# Altium schematic sheet 01_MAIN.SchDoc: =GlobalProjectName
size 594 x 420 mm; CheckedBy: A_D; Author: A_D; SheetTotal: 1; PageSetup: Record=PageOptions|CenterHorizontal=True|CenterVertical=True|PrintScale=0.70|XCorrection=1.00|YCorrection=1.00|PrintKind=2|BorderSize=5000000|LeftOffset=9000|BottomOffset=10100|Orientation=2|PaperLength=11176|PaperWidth=8636|Scale=100|PaperSource=259|PrintQuality=-3|MediaType=1|DitherType=10|PrintScaleMode=1|PaperKind=A3|PaperIndex=8
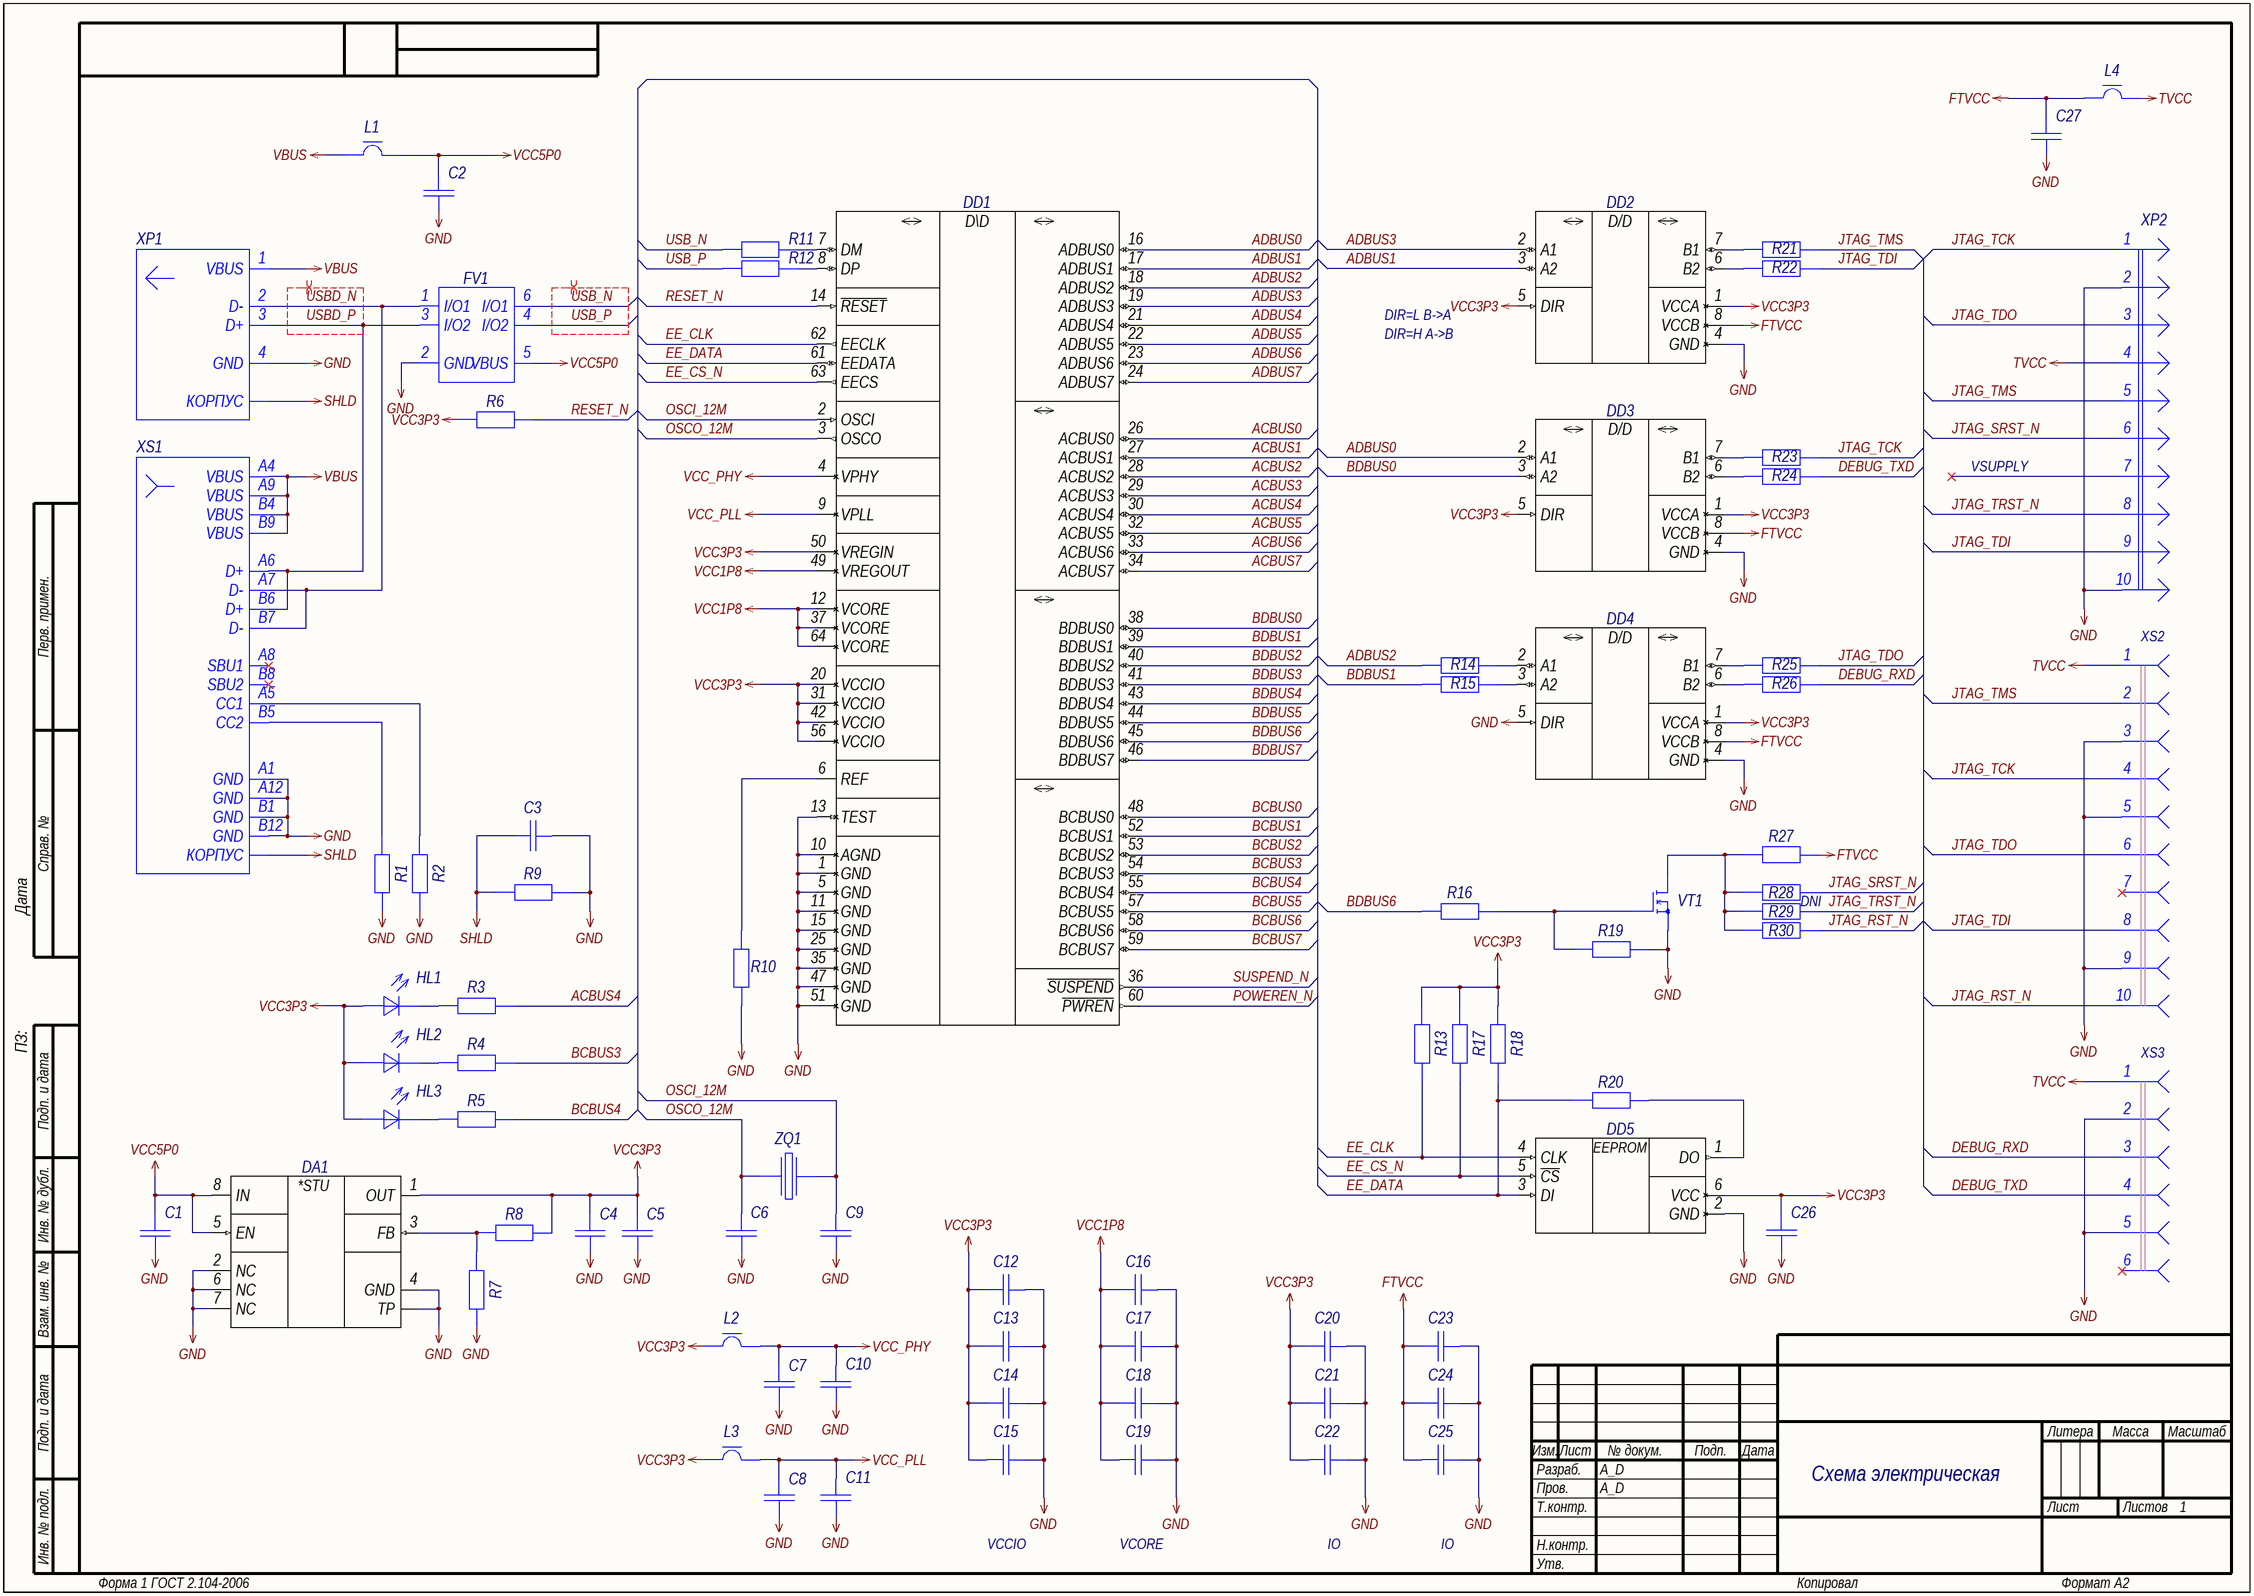
[diagram p0: 01_MAIN.SchDoc]

## Parts
C1  Capacitor  [C0402_L]  (value not drawn)
C2  Capacitor  [C0603_L]  (value not drawn)
C3  (no value)  [C0402_L]
C4  Capacitor  [C0402_L]  (value not drawn)
C5  Capacitor  [C0402_L]  (value not drawn)
C6  Capacitor  [C0402_L]  (value not drawn)
C7  Capacitor  [C0402_L]  (value not drawn)
C8  Capacitor  [C0402_L]  (value not drawn)
C9  Capacitor  [C0402_L]  (value not drawn)
C10  Capacitor  [C0402_L]  (value not drawn)
C11  Capacitor  [C0402_L]  (value not drawn)
C12  Capacitor  [C0402_L]  (value not drawn)
C13  Capacitor  [C0402_L]  (value not drawn)
C14  Capacitor  [C0402_L]  (value not drawn)
C15  Capacitor  [C0402_L]  (value not drawn)
C16  Capacitor  [C0402_L]  (value not drawn)
C17  Capacitor  [C0402_L]  (value not drawn)
C18  Capacitor  [C0402_L]  (value not drawn)
C19  Capacitor  [C0402_L]  (value not drawn)
C20  Capacitor  [C0402_L]  (value not drawn)
C21  Capacitor  [C0402_L]  (value not drawn)
C22  Capacitor  [C0402_L]  (value not drawn)
C23  Capacitor  [C0402_L]  (value not drawn)
C24  Capacitor  [C0402_L]  (value not drawn)
C25  Capacitor  [C0402_L]  (value not drawn)
C26  Capacitor  [C0402_L]  (value not drawn)
C27  Capacitor  [C0402_L]  (value not drawn)
DA1  TPS73701DRB  [VSON-8_065P300X300X100_N]  (value not drawn)
DD1  FT2232Hx-Series  [LQFP-64_050P1000X1000X160_N]  (value not drawn)
DD2  SN74LVC2T45DCx-Series  [VSSOP-8_050P200X230X090_N]  (value not drawn)
DD3  SN74LVC2T45DCx-Series  [VSSOP-8_050P200X230X090_N]  (value not drawn)
DD4  SN74LVC2T45DCx-Series  [VSSOP-8_050P200X230X090_N]  (value not drawn)
DD5  93xx56xx-OT-Series  [SOT-23-6_095P290X160X145_N]  (value not drawn)
FV1  USBLC6-2x6  [SOT-666_050P160X120X060_N]  (value not drawn)
HL1  Text  [LD0402]  (value not drawn)
HL2  Text  [LD0402]  (value not drawn)
HL3  Text  [LD0402]  (value not drawn)
L1  FerriteBead  [L0402_L]  (value not drawn)
L2  FerriteBead  [L0402_L]  (value not drawn)
L3  FerriteBead  [L0402_L]  (value not drawn)
L4  FerriteBead  [L0402_L]  (value not drawn)
R1  Resistor  [R0402_L]  (value not drawn)
R2  Resistor  [R0402_L]  (value not drawn)
R3  Resistor  [R0402_L]  (value not drawn)
R4  Resistor  [R0402_L]  (value not drawn)
R5  Resistor  [R0402_L]  (value not drawn)
R6  Resistor  [R0402_L]  (value not drawn)
R7  Resistor  [R0402_L]  (value not drawn)
R8  Resistor  [R0402_L]  (value not drawn)
R9  (no value)  [R0402_L]
R10  Resistor  [R0402_L]  (value not drawn)
R11  Resistor  [R0402_L]  (value not drawn)
R12  Resistor  [R0402_L]  (value not drawn)
R13  Resistor  [R0402_L]  (value not drawn)
R14  Resistor  [R0402_L]  (value not drawn)
R15  Resistor  [R0402_L]  (value not drawn)
R16  Resistor  [R0402_L]  (value not drawn)
R17  Resistor  [R0402_L]  (value not drawn)
R18  Resistor  [R0402_L]  (value not drawn)
R19  Resistor  [R0402_L]  (value not drawn)
R20  Resistor  [R0402_L]  (value not drawn)
R21  Resistor  [R0402_L]  (value not drawn)
R22  Resistor  [R0402_L]  (value not drawn)
R23  Resistor  [R0402_L]  (value not drawn)
R24  Resistor  [R0402_L]  (value not drawn)
R25  Resistor  [R0402_L]  (value not drawn)
R26  Resistor  [R0402_L]  (value not drawn)
R27  Resistor  [R0402_L]  (value not drawn)
R28  Resistor  [R0402_L]  (value not drawn)
R29  Resistor  [R0402_L]  (value not drawn)  (no BOM)
R30  Resistor  [R0402_L]  (value not drawn)
VT1  MOSFET-N_32  [SOT-883B_035P060X100X040_N]  (value not drawn)
XP1  Text  [DS1097]  (value not drawn)
XP2  JTAG  [IDC-10MR]  (value not drawn)
XS1  Text  [U262-161N-4BVC11]  (value not drawn)
XS2  JTAG-FFC  [XF2M-1015-1A]  (value not drawn)  (parts A,B,C,D,E,F,G,H,I,J of 10)
XS3  SWO  [XF2M-0615-1A]  (value not drawn)  (parts A,B,C,D,E,F of 6)
ZQ1  Crystal-1_3p  [SMD 3.2x2.5mm]  (value not drawn)

## Nets
FTVCC: C23.2 C24.2 C25.2 C27.2 DD2.8(VCCB) DD3.8(VCCB) DD4.8(VCCB) L4.1 R27.2
GND: C1.1 C2.1 C3.1 C4.1 C5.1 C6.1 C7.1 C8.1 C9.1 C10.1 C11.1 C12.1 C13.1 C14.1 C15.1 C16.1 C17.1 C18.1 C19.1 C20.1 C21.1 C22.1 C23.1 C24.1 C25.1 C26.2 C27.1 DA1.2(NC) DA1.4(GND) DA1.6(NC) DA1.7(NC) DA1.TP DD1.1(GND) DD1.5(GND) DD1.10(AGND) DD1.11(GND) DD1.13(TEST) DD1.15(GND) DD1.25(GND) DD1.35(GND) DD1.47(GND) DD1.51(GND) DD2.4(GND) DD3.4(GND) DD4.4(GND) DD4.5(DIR) DD5.2(GND) FV1.2(GND) R1.1 R2.1 R7.1 R9.2 R10.1 R19.2 VT1.2(S) XP1.4(GND) XP2.2 XP2.10 XS1.A1(GND) XS1.A12(GND) XS1.B1(GND) XS1.B12(GND) XS2.3 XS2.5 XS2.9 XS3.2 XS3.5
SHLD: C3.2 R9.1 XP1.SH(КОРПУС) XS1.SH(КОРПУС)
TVCC: L4.2 XP2.4 XS2.1 XS3.1
VBUS: L1.1 XP1.1(VBUS) XS1.A4(VBUS) XS1.A9(VBUS) XS1.B4(VBUS) XS1.B9(VBUS)
VCC1P8: C16.2 C17.2 C18.2 C19.2 DD1.12(VCORE) DD1.37(VCORE) DD1.49(VREGOUT) DD1.64(VCORE)
VCC3P3: C4.2 C5.2 C12.2 C13.2 C14.2 C15.2 C20.2 C21.2 C22.2 C26.1 DA1.1(OUT) DD1.20(VCCIO) DD1.31(VCCIO) DD1.42(VCCIO) DD1.50(VREGIN) DD1.56(VCCIO) DD2.1(VCCA) DD2.5(DIR) DD3.1(VCCA) DD3.5(DIR) DD4.1(VCCA) DD5.6(VCC) HL1.1(А) HL2.1(А) HL3.1(А) L2.1 L3.1 R6.1 R8.2 R13.2 R17.2 R18.2
VCC5P0: C1.2 C2.2 DA1.5(EN) DA1.8(IN) FV1.5(VBUS) L1.2
VCC_PHY: C7.2 C10.2 DD1.4(VPHY) L2.2
VCC_PLL: C8.2 C11.2 DD1.9(VPLL) L3.2
ACBUS0: DD1.26(ACBUS0)
ACBUS1: DD1.27(ACBUS1)
ACBUS2: DD1.28(ACBUS2)
ACBUS3: DD1.29(ACBUS3)
ACBUS4: DD1.30(ACBUS4) R3.2
ACBUS5: DD1.32(ACBUS5)
ACBUS6: DD1.33(ACBUS6)
ACBUS7: DD1.34(ACBUS7)
ADBUS0: DD1.16(ADBUS0) DD3.2(A1)
ADBUS1: DD1.17(ADBUS1) DD2.3(A2)
ADBUS2: DD1.18(ADBUS2) R14.1
ADBUS3: DD1.19(ADBUS3) DD2.2(A1)
ADBUS4: DD1.21(ADBUS4)
ADBUS5: DD1.22(ADBUS5)
ADBUS6: DD1.23(ADBUS6)
ADBUS7: DD1.24(ADBUS7)
BCBUS0: DD1.48(BCBUS0)
BCBUS1: DD1.52(BCBUS1)
BCBUS2: DD1.53(BCBUS2)
BCBUS3: DD1.54(BCBUS3) R4.2
BCBUS4: DD1.55(BCBUS4) R5.2
BCBUS5: DD1.57(BCBUS5)
BCBUS6: DD1.58(BCBUS6)
BCBUS7: DD1.59(BCBUS7)
BDBUS0: DD1.38(BDBUS0) DD3.3(A2)
BDBUS1: DD1.39(BDBUS1) R15.1
BDBUS2: DD1.40(BDBUS2)
BDBUS3: DD1.41(BDBUS3)
BDBUS4: DD1.43(BDBUS4)
BDBUS5: DD1.44(BDBUS5)
BDBUS6: DD1.45(BDBUS6) R16.1
BDBUS7: DD1.46(BDBUS7)
DEBUG_RXD: R26.2 XS3.3
DEBUG_TXD: R24.2 XS3.4
EE_CLK: DD1.62(EECLK) DD5.4(CLK) R13.1
EE_CS_N: DD1.63(EECS) DD5.5(~{CS}) R17.1
EE_DATA: DD1.61(EEDATA) DD5.3(DI) R18.1 R20.1
JTAG_RST_N: R30.2 XS2.10
JTAG_SRST_N: R28.2 XP2.6
JTAG_TCK: R23.2 XP2.1 XS2.4
JTAG_TDI: R22.2 XP2.9 XS2.8
JTAG_TDO: R25.2 XP2.3 XS2.6
JTAG_TMS: R21.2 XP2.5 XS2.2
JTAG_TRST_N: R29.2 XP2.8
OSCI_12M: C9.2 DD1.2(OSCI) ZQ1.3
OSCO_12M: C6.2 DD1.3(OSCO) ZQ1.1
POWEREN_N: DD1.60(~{PWREN})
RESET_N: DD1.14(~{RESET}) R6.2
SUSPEND_N: DD1.36(~{SUSPEND})
USB_N: FV1.6(I/O1) R11.1
USB_P: FV1.4(I/O2) R12.1
USBD_N: FV1.1(I/O1) XP1.2(D-) XS1.A7(D-) XS1.B7(D-)
USBD_P: FV1.3(I/O2) XP1.3(D+) XS1.A6(D+) XS1.B6(D+)
NetDA1_3: DA1.3(FB) R7.2 R8.1
NetDD1_6: DD1.6(REF) R10.2
NetDD1_7: DD1.7(DM) R11.2
NetDD1_8: DD1.8(DP) R12.2
NetDD2_6: DD2.6(B2) R22.1
NetDD2_7: DD2.7(B1) R21.1
NetDD3_6: DD3.6(B2) R24.1
NetDD3_7: DD3.7(B1) R23.1
NetDD4_2: DD4.2(A1) R14.2
NetDD4_3: DD4.3(A2) R15.2
NetDD4_6: DD4.6(B2) R26.1
NetDD4_7: DD4.7(B1) R25.1
NetDD5_1: DD5.1(DO) R20.2
NetHL1_2: HL1.2(К) R3.1
NetHL2_2: HL2.2(К) R4.1
NetHL3_2: HL3.2(К) R5.1
NetR1_2: R1.2 XS1.B5(CC2)
NetR2_2: R2.2 XS1.A5(CC1)
NetR16_2: R16.2 R19.1 VT1.1(G)
NetR27_1: R27.1 R28.1 R29.1 R30.1 VT1.3(D)

Not connected (* = marked no-connect by the designer): XP2 7*; XS1 A8(SBU1)* B8(SBU2)*; XS2 7*; XS3 6*

## Layout directives
differential pair; differential pair class USBD: USBD_N, USBD_P
differential pair; differential pair class USB: USB_N, USB_P

## Notes on the sheet
- DIR=L B->A
- DIR=H A->B
- VSUPPLY
- (near XS2) XS2
- DNI
- (near XS3) XS3
- Схема электрическая
  принципиальная
- VCCIO
- VCORE
- IO
- Перв. примен.
- Справ. №
- ПЗ:                             Дата
- Подп. и дата
- Инв. № дубл.
- Взам. инв. №
- Разраб.
- Изм.
- Лист
- № докум.
- Подп.
- Дата
- Литера
- Масса
- Масштаб
- Пров.
- Т.контр.
- Листов
- Инв. № подл.
- Н.контр.
- Утв.
- Форма 1 ГОСТ 2.104-2006
- Копировал
- Формат А2
- (in symbol 93LC56BT-I/OT) EEPROM
- (in symbol FT2232HL) D\D
- (in symbol SN74LVC2T45DCUR) D/D
- (in symbol TPS73701DRBR) *STU

## Library data of the parts
C1 = GRM155R61C105KA12D: Manufacturer: Murata; Type: Конденсатор; ID: 272; Value: 1uF; Voltage: 16V; Tolerance: ±10%; Dielectric Type: X5R; Application Category: 1; Working Temperature Min: -55°С; Working Temperature Max: +85°С; Published: 18.05.2010; Publisher: Andrew Danich; Part Number: GRM155R61C105KA12D; Footprint: 0402; ClassName: DirectConnect
C2 = GRM188R61A106KE69D: Manufacturer: Murata; Type: Конденсатор; ID: 173; Value: 10uF; Voltage: 10V; Tolerance: ±10%; Dielectric Type: X5R; Application Category: 1; Working Temperature Min: -55°С; Working Temperature Max: +85°С; Published: 18.05.2010; Publisher: Andrew Danich; Part Number: GRM188R61A106KE69D; Footprint: 0603; ClassName: DirectConnect
C3 = GCM155R71C104KA55D: Manufacturer: Murata; Type: Конденсатор; ID: 163; Value: 0.1uF; Voltage: 16V; Tolerance: ±10%; Dielectric Type: X7R; Application Category: 1; Working Temperature Min: -55°С; Working Temperature Max: +125°С; Functional Analog: GRM155R71C104KA88D; Published: 18.05.2010; Publisher: Andrew Danich; Part Number: GCM155R71C104KA55D; Footprint: 0402; ClassName: DirectConnect
C4 C5 C7 C8 C16 = GRM155R60J475ME87D: Manufacturer: Murata; Type: Конденсатор; ID: 223; Value: 4.7uF; Voltage: 6.3V; Tolerance: ±20%; Dielectric Type: X5R; Application Category: 1; Working Temperature Min: -55°С; Working Temperature Max: +85°С; Published: 18.05.2010; Publisher: Andrew Danich; Part Number: GRM155R60J475ME87D; Footprint: 0402; ClassName: DirectConnect
C6 C9 = GJM1555C1H120GB01D: Manufacturer: Murata; Type: Конденсатор; Schematic Value: 12pF, 50V, NP0; ID: 257; Value: 12pF; Voltage: 50V; Tolerance: ±2%; Dielectric Type: NP0; Application Category: 1; Working Temperature Min: -55°С; Working Temperature Max: +125°С; Published: 18.05.2010; Publisher: Andrew Danich; Part Number: GJM1555C1H120GB01D; Footprint: 0402
C10-C15 C17-C26 = GCM155R71C104KA55D: Manufacturer: Murata; Type: Конденсатор; Schematic Value: 0.1uF, 16V, X7R; ID: 163; Value: 0.1uF; Voltage: 16V; Tolerance: ±10%; Dielectric Type: X7R; Application Category: 1; Working Temperature Min: -55°С; Working Temperature Max: +125°С; Functional Analog: GRM155R71C104KA88D; Published: 18.05.2010; Publisher: Andrew Danich; Part Number: GCM155R71C104KA55D; Footprint: 0402
C27 = GRM155D71C225ME11D: Manufacturer: Murata; Type: Конденсатор; ID: 180; Value: 2.2uF; Voltage: 16V; Tolerance: ±20%; Dielectric Type: X7T; Application Category: 1; Working Temperature Min: -55°С; Working Temperature Max: +125°С; Functional Analog: GRM155R60J225ME15D; Published: 18.05.2010; Publisher: Andrew Danich; Part Number: GRM155D71C225ME11D; Footprint: 0402; ClassName: DirectConnect
DA1 = TPS73701DRBR: Manufacturer: Texas Instruments; ID: 26; Input Voltage: +2.2…5.5V; Output Current: 1A; Output Voltage: +1.2…5.5V; Application Category: 1; Working Temperature Min: -40°С; Working Temperature Max: +125°С; Functional Analog: TPS73701DRBT; Published: 25.03.2019; Publisher: Andrew Danich; Type: Микросхема; Part Number: TPS73701DRBR; Value: TPS73701DRBR; ClassName: DirectConnect
DD1 = FT2232HL: Manufacturer: FTDI; ID: 3; Supply Operation: +3.3V; Supply Current: 70mA; USB Type Support: USB 2.0; USB Speed Support: 12 Mb/s; OTG Support: No; Input Interface: UART, FIFO, SPI, JTAG, I2C; Channels: 2; Application Category: 1; Working Temperature Min: -40°C; Working Temperature Max: +85°C; Published: 19.06.2020; Publisher: Andrew Danich; Type: Микросхема; Part Number: FT2232HL; Value: FT2232HL; Functional Analog: -
DD2-DD4 = SN74LVC2T45DCUR: Manufacturer: Texas Instruments; ID: 18; Supply 1 Operation: +1,65…5,5V; Supply Current: 10uA; Directional: Unidirection; Channels: 2; Max Data Rate: 420Mbps; Application Category: 1; Working Temperature Min: -40°С; Working Temperature Max: +85°С; Functional Analog: 74LVCH2T45DC,125; Published: 06.03.2020; Publisher: Andrew Danich; Type: Микросхема; Part Number: SN74LVC2T45DCUR; Value: SN74LVC2T45DCUR; Supply 2 Operation: +1,65…5,5V
DD5 = 93LC56BT-I/OT: Manufacturer: Microchip; ID: 18; Supply Operation: +2.5…5.5V; Supply Current: 2mA; Memory: 2Kbit; Addressable: NO; Interface: SPI; Clock Frequency: 2MHz; Application Category: 1; Working Temperature Min: -40°С; Working Temperature Max: +85°С; Published: 19.06.2020; Type: Микросхема; Publisher: Andrew Danich; Part Number: 93LC56BT-I/OT; Value: 93LC56BT-I/OT
FV1 = USBLC6-2P6: Manufacturer: STMicroelectronics; ID: 30; Breakdown Voltage: 6V; Reverse Stand Off Voltage: 17V; Forward Voltage: 0.95V; Peak Forward Current: 5A; Junction Capacitance: 2.5pF; Directional: Bidirectional; Application Category: 1; Working Temperature Min: -40°С; Working Temperature Max: +125°С; Published: 21.02.2017; Publisher: Andrew Danich; Type: Супрессор; Part Number: USBLC6-2P6; Value: USBLC6-2P6; Functional Analog: -; ClassName: DirectConnect
HL1-HL3 = KPHHS-1005QBC-D-V: Manufacturer: Kingbright; Type: Индикатор единичный; ID: 24; Forward Voltage: 3.3V; Forward Current: 20mA; Power Dissipation: 120mW; Luminous Flux: 60; Color: Blue; Leds: 1; Working Temperature Min: -40°С; Working Temperature Max: +85°С; Published: 03.12.2013; Publisher: Andrew Danich; Part Number: KPHHS-1005QBC-D-V; Value: KPHHS-1005QBC-D-V; Footprint: 0402; Application Category: 1
L1-L4 = BLM15PD121SN1D: Manufacturer: Murata; Type: Дроссель; ID: 11; Rated Current: 1.3A; Impedance at 100Mhz: 120ohm; Tolerance: ±25%; DC Resistance: 0.09ohm; Inductor Type: EMIFIL; Application Category: 1; Working Temperature Min: -55°С; Working Temperature Max: +125°С; Published: 14.11.2014; Publisher: Andrew Danich; Part Number: BLM15PD121SN1D; Value: BLM15PD121SN1D; Footprint: 0402
  L1 L4: ClassName: DirectConnect
R1 R2 = RC0402FR-075K1L: Manufacturer: Yageo; ID: 496; Value: 5.1k; Limit Voltage: 50V; Tolerance: ±1%; Temperature Coefficient: 100ppm; Total Power Dissipation: 0.1W; Series Type: Thick-Film; Application Category: 1; Working Temperature Min: -55°С; Working Temperature Max: +155°С; Published: 24.03.2010; Publisher: Andrew Danich; Type: Резистор; Part Number: RC0402FR-075K1L; Footprint: 0402
R3-R5 = RC0402JR-071KL: Manufacturer: Yageo; ID: 3; Value: 1k; Limit Voltage: 50V; Tolerance: ±5%; Temperature Coefficient: 100ppm; Total Power Dissipation: 0.1W; Series Type: Thick-Film; Application Category: 1; Working Temperature Min: -55°С; Working Temperature Max: +155°С; Published: 24.03.2010; Publisher: Andrew Danich; Type: Резистор; Part Number: RC0402JR-071KL; Footprint: 0402
R6 = RC0402JR-071KL: Manufacturer: Yageo; Schematic Value: 1k ±5%; ID: 3; Value: 1k; Limit Voltage: 50V; Tolerance: ±5%; Temperature Coefficient: 100ppm; Total Power Dissipation: 0.1W; Series Type: Thick-Film; Application Category: 1; Working Temperature Min: -55°С; Working Temperature Max: +155°С; Published: 24.03.2010; Publisher: Andrew Danich; Type: Резистор; Part Number: RC0402JR-071KL; Footprint: 0402
R7 = RC0402FR-0712KL: Manufacturer: Yageo; ID: 318; Value: 12k; Limit Voltage: 50V; Tolerance: ±1%; Temperature Coefficient: 100ppm; Total Power Dissipation: 0.1W; Series Type: Thick-Film; Application Category: 1; Working Temperature Min: -55°С; Working Temperature Max: +155°С; Published: 24.03.2010; Publisher: Andrew Danich; Type: Резистор; Part Number: RC0402FR-0712KL; Footprint: 0402
R8 = RC0402FR-0722K1L: Manufacturer: Yageo; ID: 447; Value: 22.1k; Limit Voltage: 50V; Tolerance: ±1%; Temperature Coefficient: 100ppm; Total Power Dissipation: 0.1W; Series Type: Thick-Film; Application Category: 1; Working Temperature Min: -55°С; Working Temperature Max: +155°С; Published: 24.03.2010; Publisher: Andrew Danich; Type: Резистор; Part Number: RC0402FR-0722K1L; Footprint: 0402
R9 = RC0402JR-07100KL: Manufacturer: Yageo; ID: 351; Value: 100k; Limit Voltage: 50V; Tolerance: ±5%; Temperature Coefficient: 100ppm; Total Power Dissipation: 0.1W; Series Type: Thick-Film; Application Category: 1; Working Temperature Min: -55°С; Working Temperature Max: +155°С; Published: 24.03.2010; Publisher: Andrew Danich; Type: Резистор; Part Number: RC0402JR-07100KL; Footprint: 0402; ClassName: DirectConnect
R10 = RC0402FR-0712KL: Manufacturer: Yageo; Schematic Value: 12k ±1%; ID: 318; Value: 12k; Limit Voltage: 50V; Tolerance: ±1%; Temperature Coefficient: 100ppm; Total Power Dissipation: 0.1W; Series Type: Thick-Film; Application Category: 1; Working Temperature Min: -55°С; Working Temperature Max: +155°С; Published: 24.03.2010; Publisher: Andrew Danich; Type: Резистор; Part Number: RC0402FR-0712KL; Footprint: 0402
R11 R12 = RC0402JR-0710RL: Manufacturer: Yageo; Schematic Value: 10 ±5%; ID: 477; Value: 10; Limit Voltage: 50V; Tolerance: ±5%; Temperature Coefficient: 100ppm; Total Power Dissipation: 0.1W; Series Type: Thick-Film; Application Category: 1; Working Temperature Min: -55°С; Working Temperature Max: +155°С; Published: 24.03.2010; Publisher: Andrew Danich; Type: Резистор; Part Number: RC0402JR-0710RL; Footprint: 0402
R13 R17-R19 R27 = RC0402JR-0710KL: Manufacturer: Yageo; ID: 476; Value: 10k; Limit Voltage: 50V; Tolerance: ±5%; Temperature Coefficient: 100ppm; Total Power Dissipation: 0.1W; Series Type: Thick-Film; Application Category: 1; Working Temperature Min: -55°С; Working Temperature Max: +155°С; Schematic Value: 10k ±5%; Published: 24.03.2010; Publisher: Andrew Danich; Type: Резистор; Part Number: RC0402JR-0710KL; Footprint: 0402
R14-R16 R21-R26 = RC0402JR-07100RL: Manufacturer: Yageo; ID: 479; Value: 100; Limit Voltage: 50V; Tolerance: ±5%; Temperature Coefficient: 100ppm; Total Power Dissipation: 0.1W; Series Type: Thick-Film; Application Category: 1; Working Temperature Min: -55°С; Working Temperature Max: +155°С; Schematic Value: 100 ±5%; Published: 24.03.2010; Publisher: Andrew Danich; Type: Резистор; Part Number: RC0402JR-07100RL; Footprint: 0402
R20 = RC0402JR-072K2L: Manufacturer: Yageo; Schematic Value: 2.2k ±5%; ID: 379; Value: 2.2k; Limit Voltage: 50V; Tolerance: ±5%; Temperature Coefficient: 100ppm; Total Power Dissipation: 0.1W; Series Type: Thick-Film; Application Category: 1; Working Temperature Min: -55°С; Working Temperature Max: +155°С; Published: 24.03.2010; Publisher: Andrew Danich; Type: Резистор; Part Number: RC0402JR-072K2L; Footprint: 0402
R28-R30 = RC0402JR-070RL: Manufacturer: Yageo; ID: 362; Value: 0; Limit Voltage: 50V; Tolerance: ±5%; Temperature Coefficient: 100ppm; Total Power Dissipation: 0.1W; Series Type: Thick-Film; Application Category: 1; Working Temperature Min: -55°С; Working Temperature Max: +155°С; Schematic Value: 0 ±5%; Published: 24.03.2010; Publisher: Andrew Danich; Type: Резистор; Part Number: RC0402JR-070RL; Footprint: 0402
VT1 = NX3008NBKMB: Manufacturer: NXP Semiconductors; Type: Транзистор; ID: 36; D-S Voltage: 30V; Drain Current: 530mA; D-S On-Resistance: 1.4omh; Gate Capacitance: 50pF; Total Power Dissipation: 360mW; Gate Threshold Voltage: 1.1V; Application Category: 1; Working Temperature Min: -55°С; Working Temperature Max: +150°С; Published: 24.09.2010; Publisher: Andrew Danich; Part Number: NX3008NBKMB; Value: NX3008NBKMB
XP1 = DS1097-B: Manufacturer: Connfly Electronic Co., Ltd; ID: 3; Limit Voltage: 30V; Limit Current: 1.5A; Connector Type: Male; Interface: USB 2.0; Max Data Rate: 480 mbps; Application Category: 1; Functional Analog: USB-AR, DS1097-W; Published: 13.08.2015; Publisher: Andrew Danich; Type: Вилка; Part Number: DS1097-B; Value: DS1097-B; Pins: 6; Mount Type: Through hole; ClassName: DirectConnect
XP2 = IDC-10MR: ID: 11; Limit Voltage: 500V; Limit Current: 1A; Connector Type: Male; Resistance: 20mohm; Pitch: 2.54mm; Application Category: 1; Functional Analog: DS1013-10RSIB, C3510-10SPGB00; Value: IDC-10MR; Published: 07.03.2013; Publisher: Andrew Danich; Type: Вилка; Part Number: IDC-10MR; Pins: 10
XS1 = U262-161N-4BVC11: Manufacturer: XKB Enterprise; ID: 41; Limit Voltage: 30V; Limit Current: 3A; Connector Type: Female; Interface: USB 3.1 Type C; Max Data Rate: 480 mbps; Application Category: 1; Working Temperature Min: -40°С; Working Temperature Max: +85°С; Functional Analog: C167321; Published: 17.09.2018; Publisher: Andrew Danich; Type: Розетка; Part Number: U262-161N-4BVC11; Value: U262-161N-4BVC11; Pins: 16; Mount Type: Surface; ClassName: DirectConnect
XS2 = XF2M-1015-1A: Manufacturer: Omron Electronics; ID: 7; Limit Voltage: 50V; Limit Current: 500mA; Connector Type: Female; Resistance: 0.05ohm; Pitch: 0.5mm; Application Category: 1; Working Temperature Min: -30°С; Working Temperature Max: +85°С; Published: 07.09.2015; Publisher: Viktor Klishin; Type: Розетка; Part Number: XF2M-1015-1A; Value: XF2M-1015-1A; Pins: 10; Series: FPC
XS3 = XF2M-0615-1A: Manufacturer: Omron Electronics; ID: 6; Limit Voltage: 50V; Limit Current: 500mA; Connector Type: Female; Resistance: 0.05ohm; Pitch: 0.5mm; Application Category: 1; Working Temperature Min: -30°С; Working Temperature Max: +85°С; Published: 16.02.2017; Publisher: Viktor Klishin; Type: Розетка; Part Number: XF2M-0615-1A; Value: XF2M-0615-1A; Pins: 6; Series: FPC
ZQ1 = 12.88673_KX-7T-12.0MHz: Manufacturer: GEYER ELECTRONIC; ID: 25; Output Frequency: 12МГц; Load Capacitance: 12pF; Temperature Coefficient: ±30ppm; Application Category: 1; Working Temperature Min: -40°С; Working Temperature Max: +85°С; Published: 12.09.2014; Publisher: Andrew Danich; Type: Резонатор; Part Number: 12.88673_KX-7T-12.0MHz; Value: 12.88673_KX-7T-12.0MHz; Functional Analog: -